# Altium project PCB_Project_v4.PrjPcb
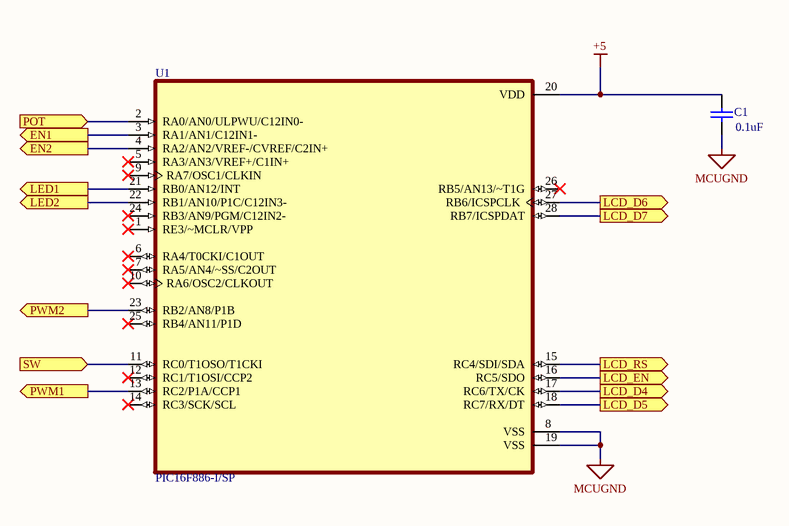
[diagram p0: Microcontroller.SchDoc]
Title: Main Schematic
1 sheet, 2 parts. Net scope: flat (ports and power ports of the same name join across sheets).
Board file: H_bridge_PCB.PcbDoc

## Sheet Microcontroller.SchDoc: MCU
size A4; DocumentNumber: 3; Revision: v1; SheetNumber: 3; SheetTotal: 4

### Parts
C1  value 0.1uF  [RAD-0.3]  (hidden comment: Cap)
U1  PIC16F886-I/SP  [DIP762W46P254L3467H457Q28]

### Ports
EN1 (out), EN2 (out), LCD_D4 (out), LCD_D5 (out), LCD_D6 (out), LCD_D7 (out), LCD_EN (out), LCD_RS (out), LED1 (out), LED2 (out), POT (in), PWM1 (out), PWM2 (out), SW (in)

### Nets
+5: C1.2 U1.20(VDD)
MCUGND: C1.1 U1.8(VSS) U1.19(VSS)
NetU1_2: U1.2(RA0/AN0/ULPWU/C12IN0-) ; port POT
NetU1_3: U1.3(RA1/AN1/C12IN1-) ; port EN1
NetU1_4: U1.4(RA2/AN2/VREF-/CVREF/C2IN+) ; port EN2
NetU1_11: U1.11(RC0/T1OSO/T1CKI) ; port SW
NetU1_13: U1.13(RC2/P1A/CCP1) ; port PWM1
NetU1_15: U1.15(RC4/SDI/SDA) ; port LCD_RS
NetU1_16: U1.16(RC5/SDO) ; port LCD_EN
NetU1_17: U1.17(RC6/TX/CK) ; port LCD_D4
NetU1_18: U1.18(RC7/RX/DT) ; port LCD_D5
NetU1_21: U1.21(RB0/AN12/INT) ; port LED1
NetU1_22: U1.22(RB1/AN10/P1C/C12IN3-) ; port LED2
NetU1_23: U1.23(RB2/AN8/P1B) ; port PWM2
NetU1_27: U1.27(RB6/ICSPCLK) ; port LCD_D6
NetU1_28: U1.28(RB7/ICSPDAT) ; port LCD_D7

Not connected (* = marked no-connect by the designer): U1 1(RE3/~MCLR/VPP)* 5(RA3/AN3/VREF+/C1IN+)* 6(RA4/T0CKI/C1OUT)* 7(RA5/AN4/~SS/C2OUT)* 9(RA7/OSC1/CLKIN)* 10(RA6/OSC2/CLKOUT)* 12(RC1/T1OSI/CCP2)* 14(RC3/SCK/SCL)* 24(RB3/AN9/PGM/C12IN2-)* 25(RB4/AN11/P1D)* 26(RB5/AN13/~T1G)*

### Library data of the parts
C1 = Cap: Capacitor; Published: 8-Jun-2000; LatestRevisionDate: 17-Jul-2002; LatestRevisionNote: Re-released for DXP Platform.; PackageReference: RAD-0.3; Publisher: Altium Limited; PackageDescription: Radial Cap, Thru-Hole; 2 Leads; 0.3 in Pin Spacing
U1 = PIC16F886-I/SP: PIC PICÂ® 16F Microcontroller IC 8-Bit 20MHz 14KB _8K x 14_ FLASH 28-SPDIP; MF: Microchip; Value: *; SnapEDA_Link: https://www.snapeda.com/parts/PIC16F886-I/SP/Microchip/view-part/44176/?ref=snap; Availability: Unavailable; Price: None; Package: DIP-28 Microchip; MP: PIC16F886-I/SP